# Altium schematic sheet MosFets.SchDoc
size A4; SheetNumber: 3; SheetTotal: 3
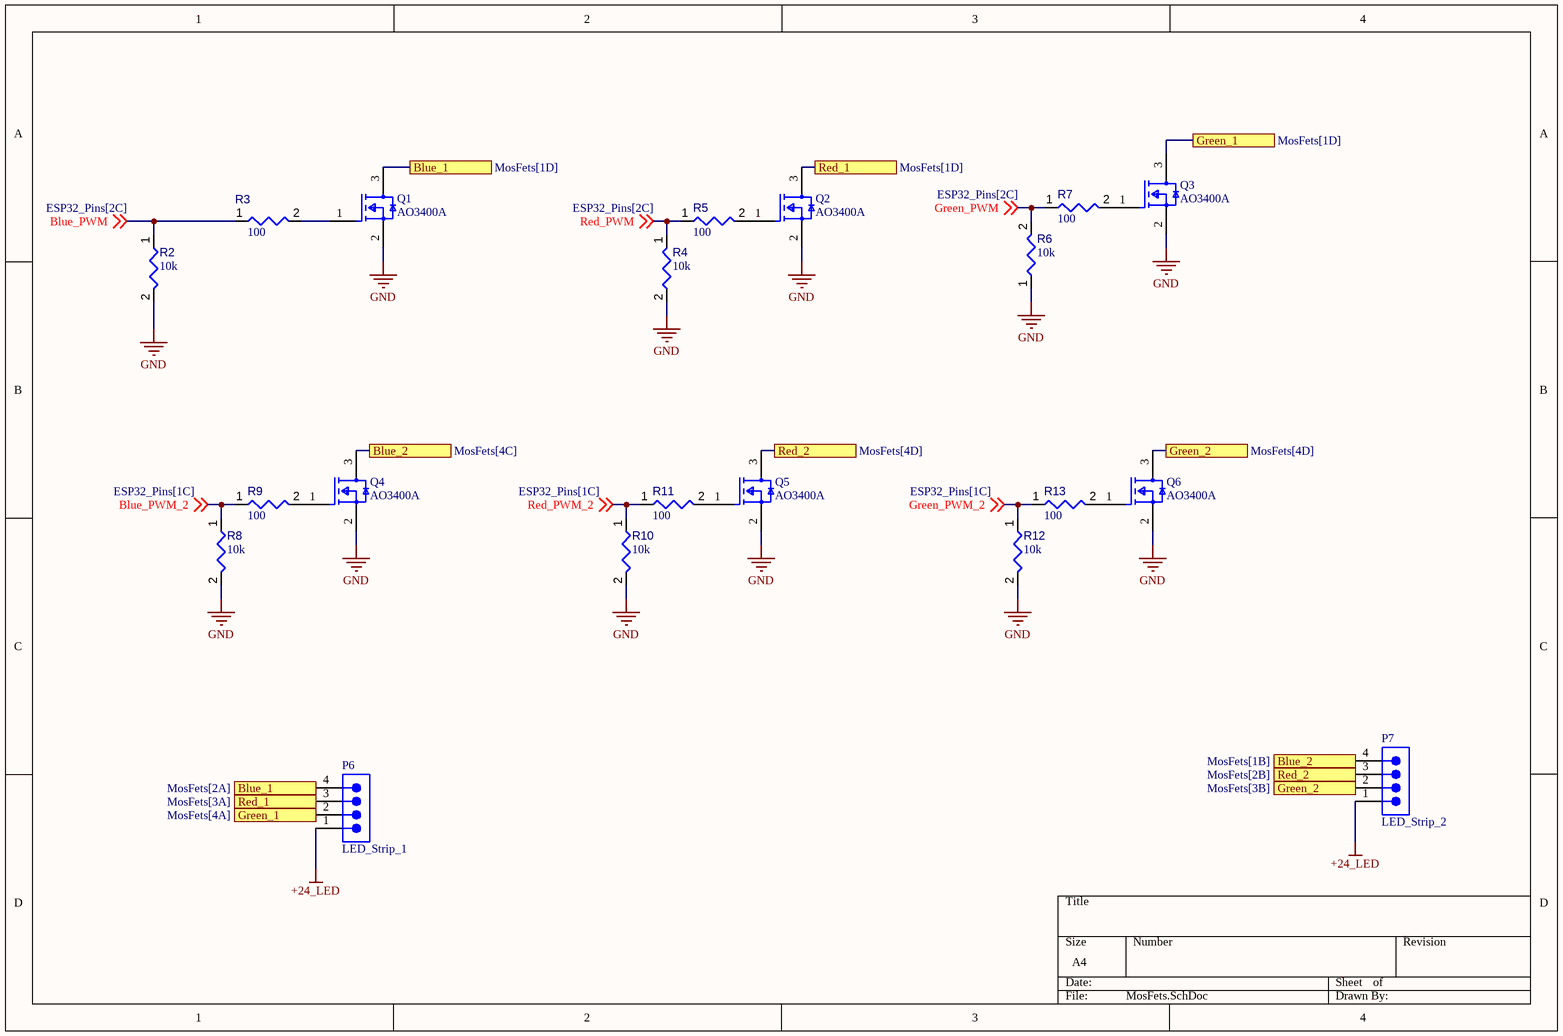
[diagram p0: MosFets.SchDoc]

## Parts
P6  LED_Strip_1  [SMTC-TSW-104-08-X-S]
P7  LED_Strip_2  [SMTC-TSW-104-08-X-S]
Q1  AO3400A  [FP-SOT23-IPC_C]
Q2  AO3400A  [FP-SOT23-IPC_C]
Q3  AO3400A  [FP-SOT23-IPC_C]
Q4  AO3400A  [FP-SOT23-IPC_C]
Q5  AO3400A  [FP-SOT23-IPC_C]
Q6  AO3400A  [FP-SOT23-IPC_C]
R2  value 10k  [FP-AC0603-IPC_C]  (hidden comment: 0603WAF1002T5E)
R3  value 100  [FP-AC0603-IPC_C]  (hidden comment: 0603WAF1000T5E)
R4  value 10k  [FP-AC0603-IPC_C]  (hidden comment: 0603WAF1002T5E)
R5  value 100  [FP-AC0603-IPC_C]  (hidden comment: 0603WAF1000T5E)
R6  value 10k  [FP-AC0603-IPC_C]  (hidden comment: 0603WAF1002T5E)
R7  value 100  [FP-AC0603-IPC_C]  (hidden comment: 0603WAF1000T5E)
R8  value 10k  [FP-AC0603-IPC_C]  (hidden comment: 0603WAF1002T5E)
R9  value 100  [FP-AC0603-IPC_C]  (hidden comment: 0603WAF1000T5E)
R10  value 10k  [FP-AC0603-IPC_C]  (hidden comment: 0603WAF1002T5E)
R11  value 100  [FP-AC0603-IPC_C]  (hidden comment: 0603WAF1000T5E)
R12  value 10k  [FP-AC0603-IPC_C]  (hidden comment: 0603WAF1002T5E)
R13  value 100  [FP-AC0603-IPC_C]  (hidden comment: 0603WAF1000T5E)

## Ports
Blue_1 (see MosFets[1D]), Blue_1 (see MosFets[2A]), Blue_2 (see MosFets[1B]), Blue_2 (see MosFets[4C]), Green_1 (see MosFets[1D]), Green_1 (see MosFets[4A]), Green_2 (see MosFets[3B]), Green_2 (see MosFets[4D]), Red_1 (see MosFets[1D]), Red_1 (see MosFets[3A]), Red_2 (see MosFets[2B]), Red_2 (see MosFets[4D])

## Nets
+24_LED: P6.1 P7.1
GND: Q1.2(S) Q2.2(S) Q3.2(S) Q4.2(S) Q5.2(S) Q6.2(S) R2.2 R4.2 R6.1 R8.2 R10.2 R12.2
Blue_1: P6.4 Q1.3(D) ; port Blue_1
Blue_2: P7.4 Q4.3(D) ; port Blue_2
Blue_PWM: R2.1 R3.1 ; off-sheet Blue_PWM
Blue_PWM_2: R8.1 R9.1 ; off-sheet Blue_PWM_2
Green_1: P6.2 Q3.3(D) ; port Green_1
Green_2: P7.2 Q6.3(D) ; port Green_2
Green_PWM: R6.2 R7.1 ; off-sheet Green_PWM
Green_PWM_2: R12.1 R13.1 ; off-sheet Green_PWM_2
Red_1: P6.3 Q2.3(D) ; port Red_1
Red_2: P7.3 Q5.3(D) ; port Red_2
Red_PWM: R4.1 R5.1 ; off-sheet Red_PWM
Red_PWM_2: R10.1 R11.1 ; off-sheet Red_PWM_2
NetQ1_1: Q1.1(G) R3.2
NetQ2_1: Q2.1(G) R5.2
NetQ3_1: Q3.1(G) R7.2
NetQ4_1: Q4.1(G) R9.2
NetQ5_1: Q5.1(G) R11.2
NetQ6_1: Q6.1(G) R13.2

## Library data of the parts
P6 P7 = CMP-002-00072-1: Conn Unshrouded Header HDR 4 POS 2.54mm Solder ST Top Entry Thru-Hole Bulk; Connector Type: Male Pin; Max Current Rating: 7.6A; Gender: Male; Min Operating Temperature: -55°C; Case/Package: Plugin,P=2.54mm; Pitch: 2.54mm; Max Operating Temperature: 125°C; Mounting Technology: Throgh Hole; Pins: 4; Contact Material: Bronze
Q1 = CMP-013-00034-2: -55℃~+150℃ 1 N-channel 1.45V 1.4W 30V 48mΩ@2.5V 5.7A 50pF 630pF 75pF 7nC@10V N-Channel SOT-23 MOSFETs ROHS; Manufacturer: Alpha & Omega Semicon; Gate to Source Voltage (Vgs): 12V; Turn-Off Delay Time: 25ns; Number of Elements: 1; Threshold Voltage: 650mV; Turn-On Delay Time: 3ns; Max Junction Temperature (Tj): 150°C; Drain to Source Resistance: 26.5mΩ; Number of Terminals: 3; Input Capacitance: 630pF; Case/Package: SOT-23; Lifecycle Status: Production; Min Operating Temperature: -55°C; Export Control Classification Number (ECCN) Code: EAR99; Max Power Dissipation: 1.4W; Max Operating Temperature: 150°C; Continuous Drain Current (ID): 5.7A; Power Dissipation: 1.4W; Introduction Date: 2007-04-17; Drain to Source Breakdown Voltage: 30V; Radiation Hardening: No; Height: 1.25mm; Lead Free: Lead Free; RoHS: Compliant; Min Breakdown Voltage: 30V; REACH SVHC: Yes; Drain to Source Voltage (Vdss): 30V; Number of Channels: 1; Pins: 3; Schedule B: 8541290080, 8541290080; Rds On Max: 26.5mΩ; Country of Origin: Mainland China; Mounting Technology: Surface Mount; MFR.Part #: AO3400A; JLCPCB Part #: C20917
Q2-Q6 = CMP-013-00034-1: Trans MOSFET N-CH 30V 5.7A 3-Pin SOT-23; Input Capacitance: 630pF; Max Power Dissipation: 1.4W; Gate to Source Voltage (Vgs): 12V; Turn-Off Delay Time: 25ns; Number of Elements: 1; Threshold Voltage: 650mV; Turn-On Delay Time: 3ns; Max Junction Temperature (Tj): 150°C; Drain to Source Resistance: 26.5mΩ; Number of Terminals: 3; Case/Package: SOT-23; Lifecycle Status: Production; Min Operating Temperature: -55°C; Export Control Classification Number (ECCN) Code: EAR99; Max Operating Temperature: 150°C; Continuous Drain Current (ID): 5.7A; Power Dissipation: 1.4W; Introduction Date: 2007-04-17; Drain to Source Breakdown Voltage: 30V; Radiation Hardening: No; Height: 1.25mm; Lead Free: Lead Free; RoHS: Compliant; Min Breakdown Voltage: 30V; REACH SVHC: Yes; Drain to Source Voltage (Vdss): 30V; Number of Channels: 1; Pins: 3; Schedule B: 8541290080, 8541290080; Rds On Max: 26.5mΩ; Country of Origin: Mainland China; Mounting Technology: Surface Mount
R2 R4 R8 R10 R12 = CMP-009-00177-1: Res Thick Film 0603 10K Ohm 1% 0.1W(1/10W) ±100ppm/C Pad SMD; Tolerance: 5%; Voltage Rating: 75V; Max Operating Temperature: 155°C; Mounting Technology: Surface Mount; Case/Package: 0603; Min Operating Temperature: -55°C
R3 R5 R7 R9 R11 R13 = CMP-009-00178-1: -55℃~+155℃ 100mW 100Ω 75V Thick Film Resistor ±1% ±100ppm/℃ 0603 Chip Resistor - Surface Mount ROHS; Manufacturer: UNI-ROYAL(Uniroyal Elec); Pins: 2; Power: 100mW; JLCPCB Part #: C22775; Min Operating Temperature: -55°C; MFR.Part #: 0603WAF1000T5E; Case/Package: 0603; Mounting Technology: SMD; Max Operating Temperature: 155°C; Tolerance: 1%; Voltage Rating: 75V
R6 = CMP-009-00177-2: Res Thick Film 0603 10K Ohm 1% 0.1W(1/10W) ±100ppm/C Pad SMD; Manufacturer: UNI-ROYAL(Uniroyal Elec); Tolerance: 5%; Voltage Rating: 75V; Max Operating Temperature: 155°C; Mounting Technology: Surface Mount; Case/Package: 0603; Min Operating Temperature: -55°C; JLCPCB Part #: C25804; MFR.Part #: 0603WAF1002T5E